# EAGLE design tester tlumivek (EAGLE 7.7.0)
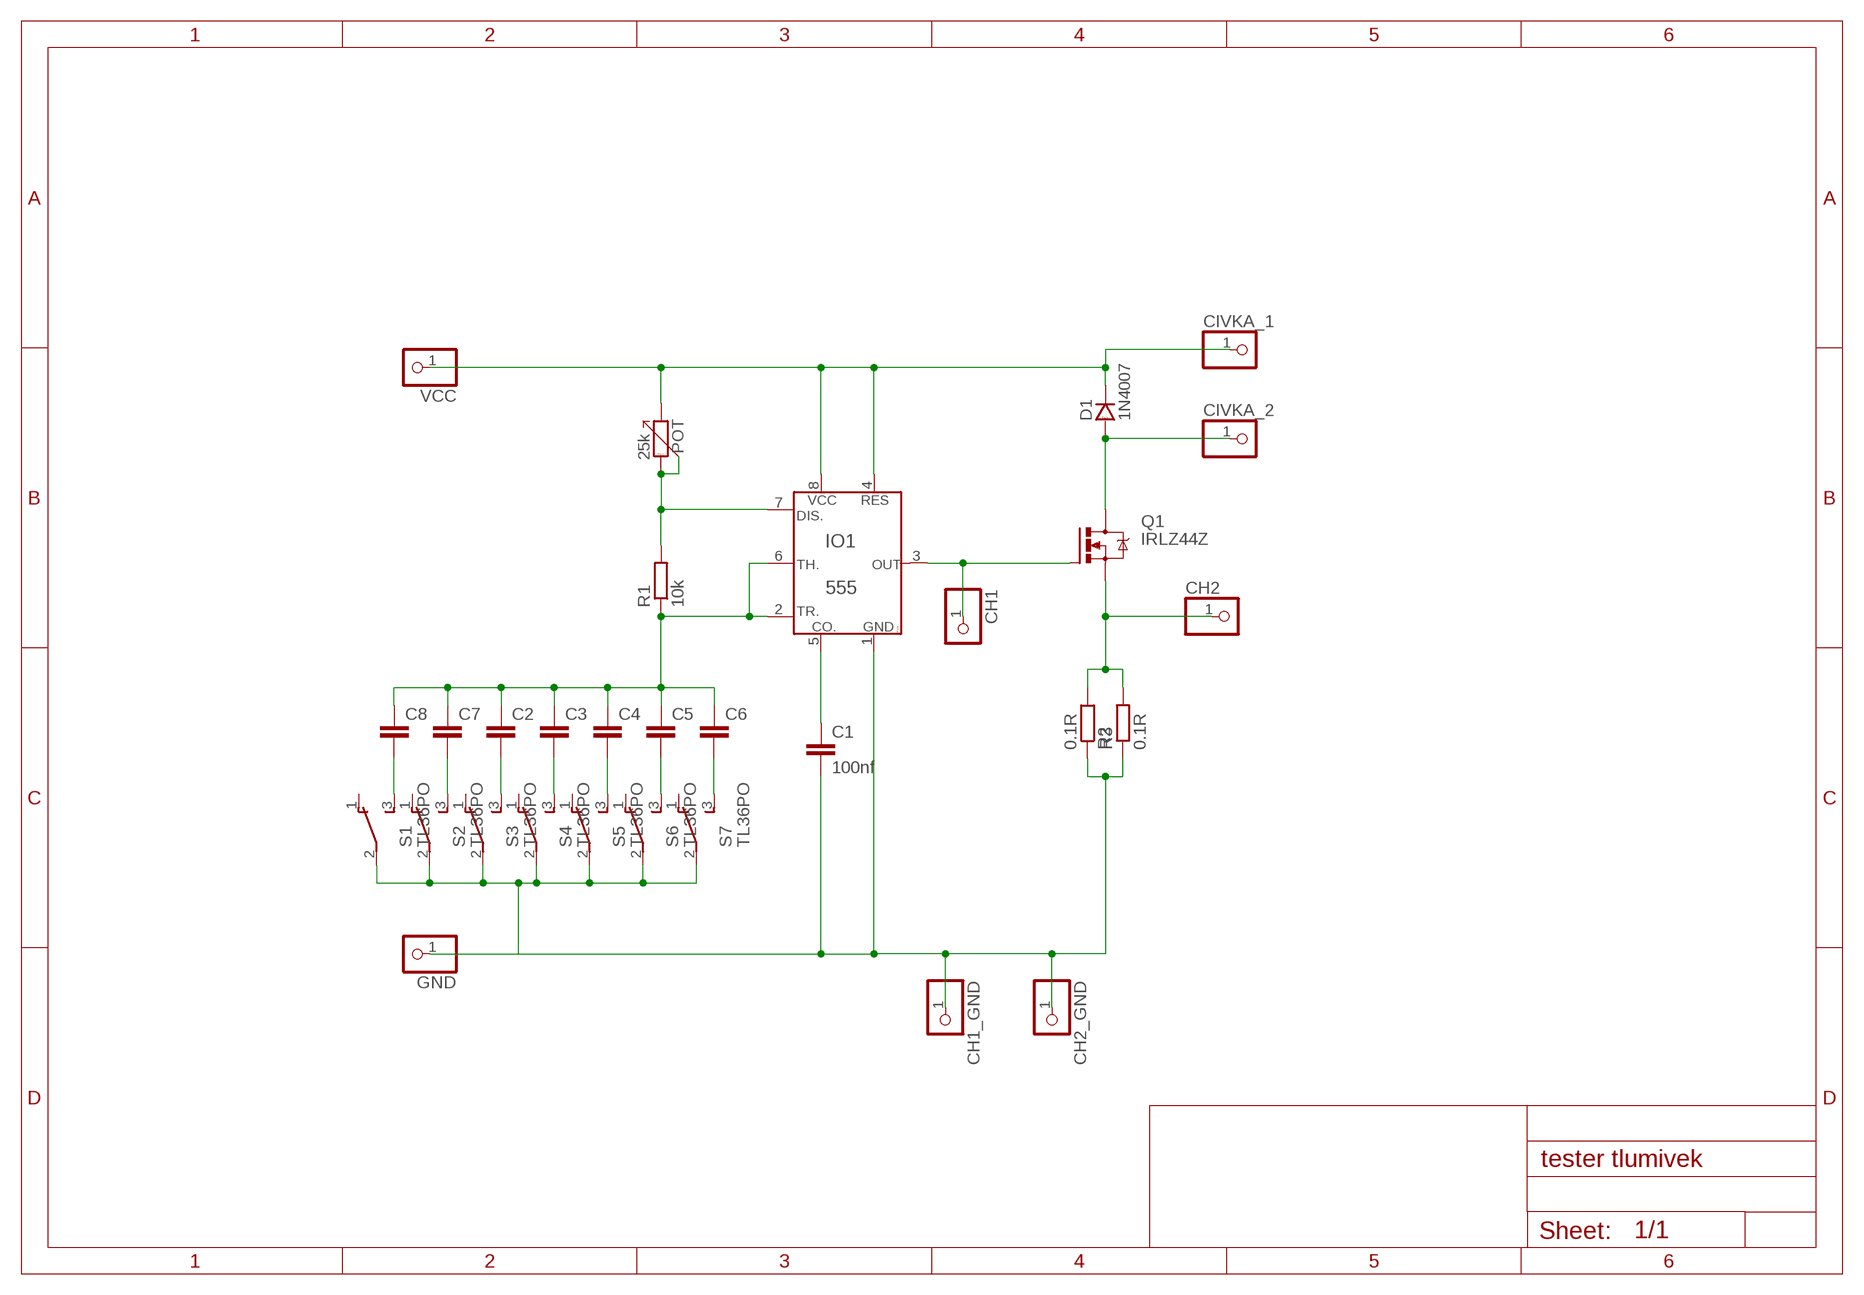
[diagram p0: schematic, sheet 1]

## Parts
C1  100nf  C-EU075-042X103  [C075-042X103]
C2  C-EU075-042X103  [C075-042X103]
C3  C-EU075-042X103  [C075-042X103]
C4  C-EU075-042X103  [C075-042X103]
C5  C-EU075-042X103  [C075-042X103]
C6  C-EU075-042X103  [C075-042X103]
C7  C-EU075-042X103  [C075-042X103]
C8  C-EU075-042X103  [C075-042X103]
CH1  PINHD-1X1  [1X01]
CH1_GND  PINHD-1X1  [1X01]
CH2  PINHD-1X1  [1X01]
CH2_GND  PINHD-1X1  [1X01]
CIVKA_1  PINHD-1X1  [1X01]
CIVKA_2  PINHD-1X1  [1X01]
D1  1N4007  [DO41]
GND  PINHD-1X1  [1X01]
IO1  555  [DIL8]
POT  25k  PC16ML  [PC16ML]
Q1  IRLZ44Z  [TO220BH]
R1  10k  R-EU_0207/10  [0207/10]
R2  0.1R  R-EU_0617/17  [0617/17]
R3  0.1R  R-EU_0617/17  [0617/17]
S1  TL36PO  [TL3XPO]
S2  TL36PO  [TL3XPO]
S3  TL36PO  [TL3XPO]
S4  TL36PO  [TL3XPO]
S5  TL36PO  [TL3XPO]
S6  TL36PO  [TL3XPO]
S7  TL36PO  [TL3XPO]
VCC  PINHD-1X1  [1X01]

## Nets
N$1: CIVKA_1.1 D1.K IO1.4(RES) IO1.8(VCC) POT.1 VCC.1
N$2: C1.1 IO1.5(CO.)
N$5: IO1.7(DIS.) POT.2 POT.3 R1.2
N$6: C8.2 S1.3(S)
N$7: CH1.1 IO1.3(OUT) Q1.G
N$8: CIVKA_2.1 D1.A Q1.D
N$9: CH2.1 Q1.S R2.2 R3.2
N$10: C7.2 S2.3(S)
N$11: C1.2 CH1_GND.1 CH2_GND.1 GND.1 IO1.1(GND) R2.1 R3.1 S1.2(P) S2.2(P) S3.2(P) S4.2(P) S5.2(P) S6.2(P) S7.2(P)
N$12: C2.2 S3.3(S)
N$13: C3.2 S4.3(S)
N$14: C4.2 S5.3(S)
N$15: C5.2 S6.3(S)
N$16: C6.2 S7.3(S)
N$17: C2.1 C3.1 C4.1 C5.1 C6.1 C7.1 C8.1 IO1.2(TR.) IO1.6(TH.) R1.1
Unconnected: S1.1(O) S2.1(O) S3.1(O) S4.1(O) S5.1(O) S6.1(O) S7.1(O)

## Library data of the parts
C1-C8 = rcl:C-EU: CAPACITOR, European symbol
CH1 CH1_GND CH2 CH2_GND CIVKA_1 CIVKA_2 GND VCC = pinhead:PINHD-1X1: PIN HEADER
D1 = #PaJa_31:1N4007: Usmernovaci dioda - 1A, 1000V
IO1 = #PaJa_31:555: IO - Casovac 555
POT = #PaJa_31:PC16ML: Potenciometr - plastovy - mono - 100R az 5M
Q1 = transistor-power:IRLZ44Z: N-Channel HEXFET® Power MOSFET Logic Level AUTOMOTIVE MOSFET Source: http://www.irf.com/product-info/datasheets/data/irlz44zpbf.pdf
R1-R3 = rcl:R-EU_: RESISTOR, European symbol
S1-S7 = switch:TL36PO: TINY SWITCH ON - ON Source: http://www2.produktinfo.conrad.com/datenblaetter/700000-724999/705152-da-01-de-Subminiaturschalter_TL_36YO.pdf

## Board
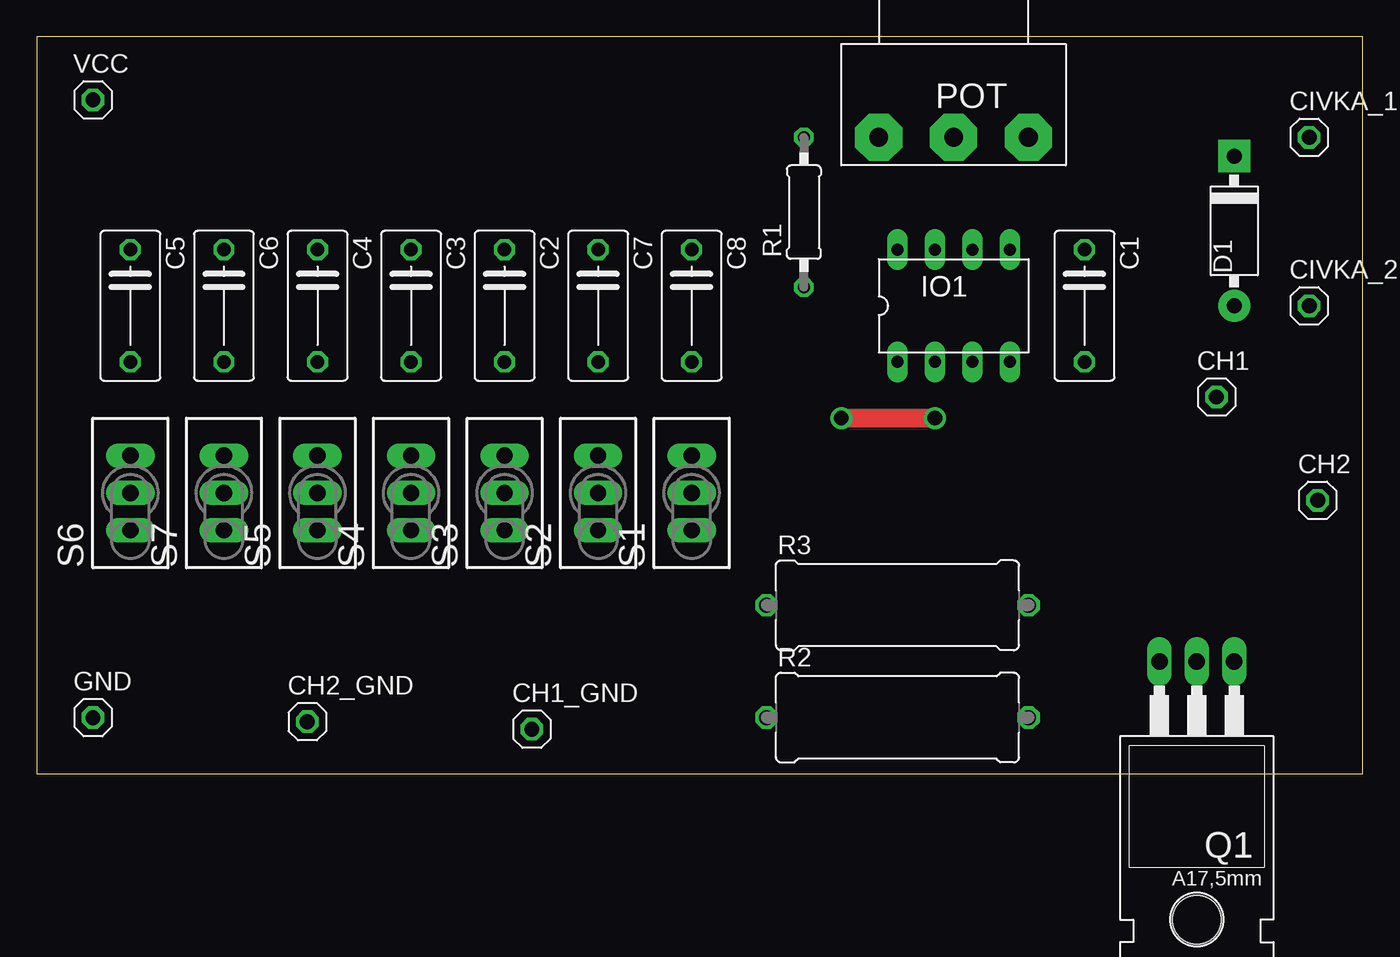
[diagram p1: board, top side]
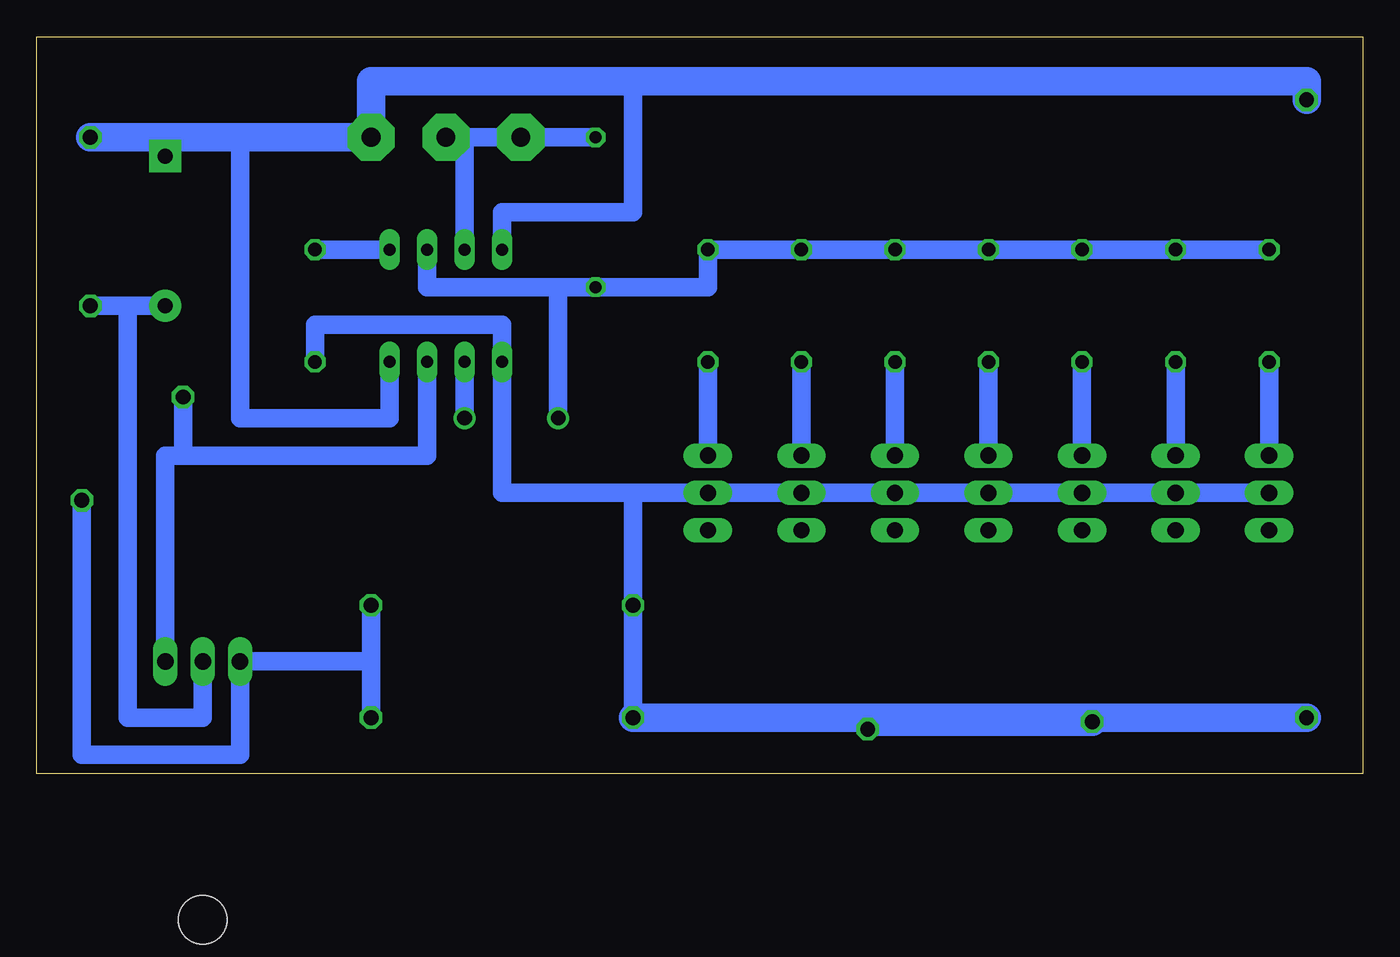
[diagram p2: board, bottom side, seen from below]

Size 90 x 50 mm. Coordinates in mm from the lower left corner, seen from the top.
Outline: 0,0 90,0 90,50 0,50 0,0
Copper layers (1*16): Top 0.035mm / dielectric 1.5mm / Bottom 0.035mm
Design rules "default": minimum track width 10mil, minimum drill 24mil, track to track 8mil, track to pad 8mil, pad to pad 8mil, via to via 8mil, smd to smd 8mil, copper to edge 40mil, drill to drill 8mil, minimum pad ring 10mil, minimum via ring 8mil, stop-mask expansion 4mil, vias tented up to drill 0mil, thermal gap 10mil

### Footprints (pad centres in the part's own frame; a part is rotated, then mirrored left to right if it is on the bottom)
C075-042X103 = drill 0.914 octagon: 1 -3.81,0; 2 3.81,0
1X01 = drill 1.016 octagon: 1 0,0
DO41 = drill 1.016 pad 2.184: A -5.08,0 | drill 1.016 pad 2.184 square: K 5.08,0
DIL8 = drill 0.813 pad 1.4 long: 1 -3.81,-3.81; 2 -1.27,-3.81; 3 1.27,-3.81; 4 3.81,-3.81; 5 3.81,3.81; 6 1.27,3.81; 7 -1.27,3.81; 8 -3.81,3.81
PC16ML = drill 1.27 pad 3.2 octagon: 1 -5.08,0; 2 5.08,0; 3 0,0
TO220BH = drill 1.118 long: D 0,-6.35; G -2.54,-6.35; S 2.54,-6.35 | hole 3.302: 0,11.176
0207/10 = drill 0.813 octagon: 1 -5.08,0; 2 5.08,0
0617/17 = drill 1.016 octagon: 1 -8.89,0; 2 8.89,0
TL3XPO = drill 1.1 pad 1.422 long: 1 -2.54,0; 2 0,0; 3 2.54,0

### Placement (x,y rotation side)
C1  71.12,31.75 270 top
C2  31.75,31.75 270 top
C3  25.4,31.75 270 top
C4  19.05,31.75 270 top
C5  6.35,31.75 270 top
C6  12.7,31.75 270 top
C7  38.1,31.75 270 top
C8  44.45,31.75 270 top
CH1  80.08,25.56 0 top
CH1_GND  33.6,3.02 0 top
CH2  86.94,18.55 0 top
CH2_GND  18.36,3.53 0 top
CIVKA_1  86.36,43.18 0 top
CIVKA_2  86.36,31.75 0 top
D1  81.28,36.83 90 top
GND  3.81,3.81 0 top
IO1  62.23,31.75 0 top
POT  62.23,43.18 180 top
Q1  78.74,1.27 180 top
R1  52.07,38.1 90 top
R2  58.42,3.81 0 top
R3  58.42,11.43 0 top
S1  44.45,19.05 90 top
S2  38.1,19.05 90 top
S3  31.75,19.05 90 top
S4  25.4,19.05 90 top
S5  19.05,19.05 90 top
S6  6.35,19.05 90 top
S7  12.7,19.05 90 top
VCC  3.81,45.72 0 top

### Tracks (layer width: path | path; a pad name or v marks a point on that pad's centre or on a via)
N$1
  Bottom 1.27: D1.K 81.28,43.18 | IO1.4 66.04,24.13 76.2,24.13 76.2,43.18 | IO1.8 58.42,38.1 49.53,38.1 49.53,46.99
  Bottom 1.93: VCC.1 3.81,46.99 49.53,46.99 67.31,46.99 POT.1 76.2,43.18 81.28,43.18 CIVKA_1.1
N$2
  Bottom 1.27: C1.1 IO1.5
N$3  (via drill 1)
  other vias: 60.96,24.13
N$4  (via drill 1)
  other vias: 54.61,24.13
N$5
  Bottom 1.27: R1.2 POT.2 60.96,43.18 | 60.96,43.18 POT.3 | IO1.7 60.96,43.18
N$6
  Bottom 1.27: C8.2 S1.3
N$7
  Bottom 1.27: Q1.G 81.28,21.59 80.08,21.59 | 80.08,21.59 CH1.1 | 80.08,21.59 63.5,21.59 IO1.3
N$8
  Bottom 1.27: CIVKA_2.1 83.82,31.75 | 83.82,31.75 D1.A | Q1.D 78.74,3.81 83.82,3.81 83.82,31.75
N$9
  Bottom 1.27: 67.31,7.62 R3.2 | R2.2 67.31,7.62 | 67.31,7.62 Q1.S 76.2,1.27 86.94,1.27 CH2.1
N$10
  Bottom 1.27: C7.2 S2.3
N$11
  Bottom 1.27: R2.1 R3.1 49.53,19.05 S1.2 | S6.2 S7.2 S5.2 S4.2 S3.2 S2.2 S1.2 | S1.2 58.42,19.05 IO1.1 58.42,30.48 71.12,30.48 C1.2 | 18.36,3.81 CH2_GND.1 | 33.6,3.53 CH1_GND.1
  Bottom 1.93: GND.1 18.36,3.81 R2.1 | CH2_GND.1 33.6,3.53
N$12
  Bottom 1.27: C2.2 S3.3
N$13
  Bottom 1.27: C3.2 S4.3
N$14
  Bottom 1.27: C4.2 S5.3
N$15
  Bottom 1.27: C5.2 S6.3
N$16
  Bottom 1.27: C6.2 S7.3
N$17  (via drill 1)
  Top 1.27: v60.96,24.13 v54.61,24.13
  Bottom 1.27: IO1.6 63.5,33.02 54.61,33.02 | 54.61,33.02 R1.1 44.45,33.02 C8.1 C7.1 C2.1 C3.1 C4.1 C6.1 C5.1 | IO1.2 v60.96,24.13 | v54.61,24.13 54.61,33.02